# EAGLE schematic BSB-LAN-Full-SS (EAGLE 6.6.0)
REVISION: v1.0

## Sheet 1 of 4
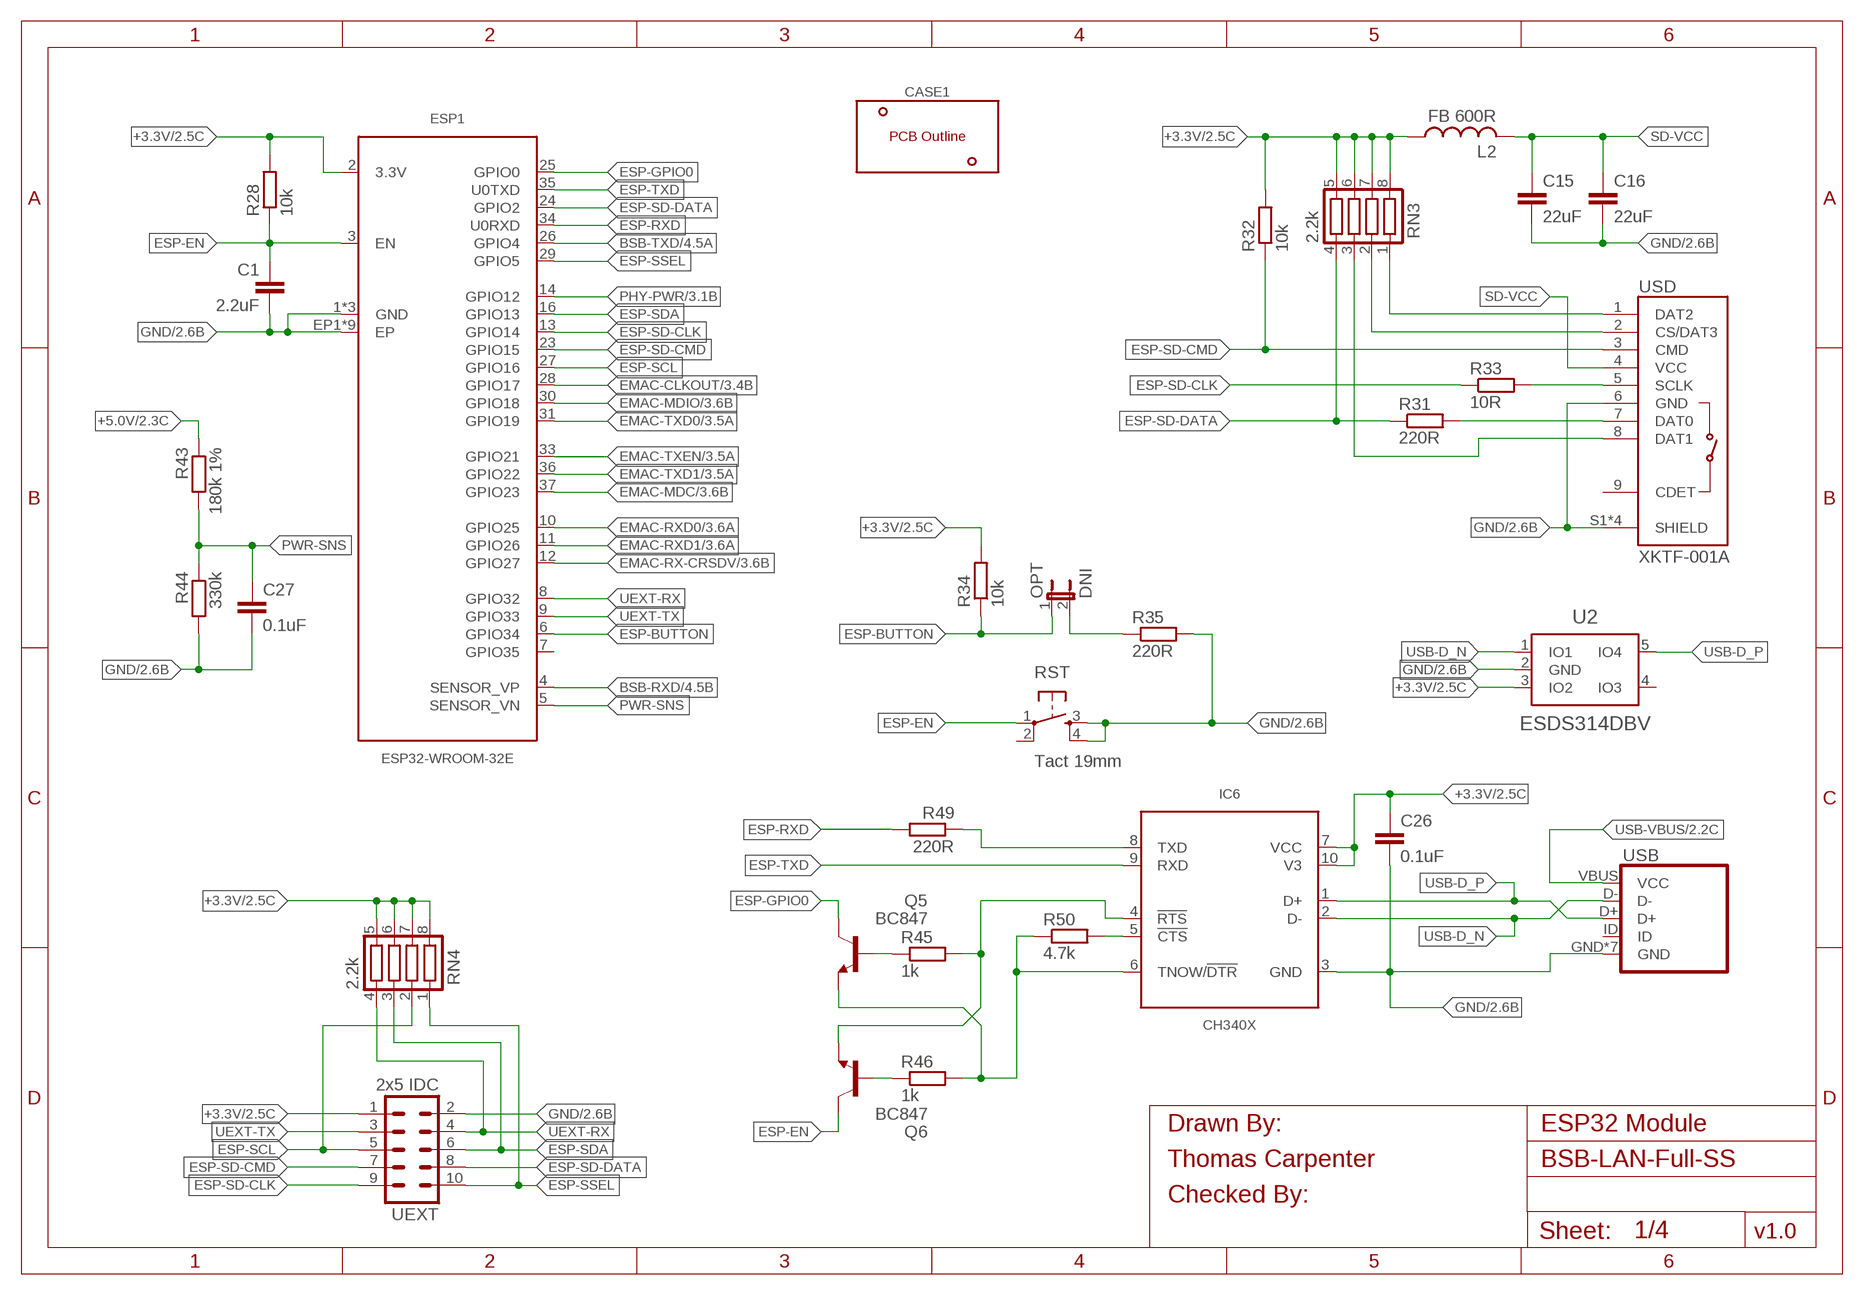
[diagram p0: schematic, sheet 1]
FRAME4 (A4L-LOC): DRAWN_BY: Thomas Carpenter; SHEET_NAME: ESP32 Module

### Parts
C1  2.2uF  C-EUC0603  [C0603]
C15  22uF  C-EUC0805L  [C0805L]
C16  22uF  C-EUC0805L  [C0805L]
C26  0.1uF  C-EUC0402  [C0402]
C27  0.1uF  C-EUC0402  [C0402]
CASE1  DNI  CNMB/3  [CNMB/3-]
ESP1  ESP32-WROOM-32E  [ESP32-WROOM-32E]
IC6  CH340X  [MSOP10]
L2  FB 600R  L-USL0805  [L2010]
OPT  DNI  JUMPER-2-PTH  [1X02]
Q5  BC847  [SOT23]
Q6  BC847  [SOT23]
R28  10k  R-EU_R0402  [R0402]
R31  220R  R-EU_R0402  [R0402]
R32  10k  R-EU_R0402  [R0402]
R33  10R  R-EU_R0603L  [R0603L]
R34  10k  R-EU_R0402  [R0402]
R35  220R  R-EU_R0402  [R0402]
R43  180k 1%  R-EU_R0402  [R0402]
R44  330k  R-EU_R0603L  [R0603L]
R45  1k  R-EU_R0402  [R0402]
R46  1k  R-EU_R0402  [R0402]
R49  220R  R-EU_R0402  [R0402]
R50  4.7k  R-EU_R0402  [R0402]
RN3  2.2k  R-NET-04-R1206  [CTS742C083]
RN4  2.2k  R-NET-04-R1206  [CTS742C083]
RST  Tact 19mm  SWITCH-MOMENTARY  [TACTILE_SWITCH]
U2  ESDS314DBV  [DBV0005A-SOT23]
UEXT  2x5 IDC  ML10  [ML10]
USB  ZX62-B-5PA(33)  USB_MICROB_PLUG  [USB-MICROB]
USD  XKTF-001A  MICROSD  [MICRO-SD]

### Nets
+3.3V [ESP32]: C26.1 ESP1.2(3.3V) IC6.7(VCC) IC6.10(V3) L2.1 R28.2 R32.2 R34.2 RN3.5 RN3.6 RN3.7 RN3.8 RN4.5 RN4.6 RN4.7 RN4.8 U2.3(IO2) UEXT.1 ; also sheet 2,3,4
+5.0V [ESP32]: R43.1 ; also sheet 2
BSB-RXD [ESP32]: ESP1.4(SENSOR_VP) ; also sheet 4
BSB-TXD [ESP32]: ESP1.26(GPIO4) ; also sheet 4
CH340-!CTS [ESP32]: IC6.5(!CTS) R50.2
CH340-!DTR [ESP32]: IC6.6(TNOW/!DTR) Q5.2(E) R46.2 R50.1
CH340-!RTS [ESP32]: IC6.4(!RTS) Q6.2(E) R45.2
CH340-TXD [ESP32]: IC6.8(TXD) R49.1
EMAC-CLKOUT [ESP32]: ESP1.28(GPIO17) ; also sheet 3
EMAC-MDC [ESP32]: ESP1.37(GPIO23) ; also sheet 3
EMAC-MDIO [ESP32]: ESP1.30(GPIO18) ; also sheet 3
EMAC-RX-CRSDV [ESP32]: ESP1.12(GPIO27) ; also sheet 3
EMAC-RXD0 [ESP32]: ESP1.10(GPIO25) ; also sheet 3
EMAC-RXD1 [ESP32]: ESP1.11(GPIO26) ; also sheet 3
EMAC-TXD0 [ESP32]: ESP1.31(GPIO19) ; also sheet 3
EMAC-TXD1 [ESP32]: ESP1.36(GPIO22) ; also sheet 3
EMAC-TXEN [ESP32]: ESP1.33(GPIO21) ; also sheet 3
ESP-BUTTON [ESP32]: ESP1.6(GPIO34) OPT.1 R34.1
ESP-BUTTON-R [ESP32]: OPT.2 R35.1
ESP-EN [ESP32]: C1.1 ESP1.3(EN) Q6.3(C) R28.1 RST.1
ESP-EN-OE [ESP32]: Q6.1(B) R46.1
ESP-GPIO0 [ESP32]: ESP1.25(GPIO0) Q5.3(C)
ESP-GPIO0-OE [ESP32]: Q5.1(B) R45.1
ESP-RXD [ESP32]: ESP1.34(U0RXD) R49.2
ESP-SCL [ESP32]: ESP1.27(GPIO16) RN4.2 UEXT.5
ESP-SD-CLK [ESP32]: ESP1.13(GPIO14) R33.1 UEXT.9
ESP-SD-CMD [ESP32]: ESP1.23(GPIO15) R32.1 UEXT.7 USD.3(CMD)
ESP-SD-DATA [ESP32]: ESP1.24(GPIO2) R31.1 RN3.4 UEXT.8
ESP-SDA [ESP32]: ESP1.16(GPIO13) RN4.3 UEXT.6
ESP-SSEL [ESP32]: ESP1.29(GPIO5) RN4.1 UEXT.10
ESP-TXD [ESP32]: ESP1.35(U0TXD) IC6.9(RXD)
GND [ESP32]: C1.2 C15.2 C16.2 C26.2 C27.2 ESP1.1(GND) ESP1.15(GND) ESP1.38(GND) ESP1.EP1(EP) ESP1.EP2(EP) ESP1.EP3(EP) ESP1.EP4(EP) ESP1.EP5(EP) ESP1.EP6(EP) ESP1.EP7(EP) ESP1.EP8(EP) ESP1.EP9(EP) IC6.3(GND) R35.2 R44.2 RST.3 RST.4 U2.2(GND) UEXT.2 USB.GND USB.MT1(GND) USB.MT2(GND) USB.MT3(GND) USB.MT4(GND) USB.MT5(GND) USB.MT6(GND) USD.6(GND) USD.S1(SHIELD) USD.S2(SHIELD) USD.S3(SHIELD) USD.S4(SHIELD) ; also sheet 2,3,4
PHY-PWR [ESP32]: ESP1.14(GPIO12) ; also sheet 3
PWR-SNS [ESP32]: C27.1 ESP1.5(SENSOR_VN) R43.2 R44.1
SD-DAT0 [ESP32]: R31.2 USD.7(DAT0)
SD-DAT1 [ESP32]: RN3.3 USD.8(DAT1)
SD-DAT2 [ESP32]: RN3.1 USD.1(DAT2)
SD-DAT3 [ESP32]: RN3.2 USD.2(CS/DAT3)
SD-SCLK [ESP32]: R33.2 USD.5(SCLK)
SD-VCC [ESP32]: C15.1 C16.1 L2.2 USD.4(VCC)
UEXT-RX: ESP1.8(GPIO32) RN4.4 UEXT.4
UEXT-TX [ESP32]: ESP1.9(GPIO33) UEXT.3
USB-D_N [100R]: IC6.2(D-) U2.1(IO1) USB.D-
USB-D_P [100R]: IC6.1(D+) U2.5(IO4) USB.D+
USB-VBUS [ESP32]: USB.VBUS(VCC) ; also sheet 2
Unconnected: ESP1.7(GPIO35) RST.2 U2.4(IO3) USB.ID USD.9(CDET)

## Sheet 2 of 4
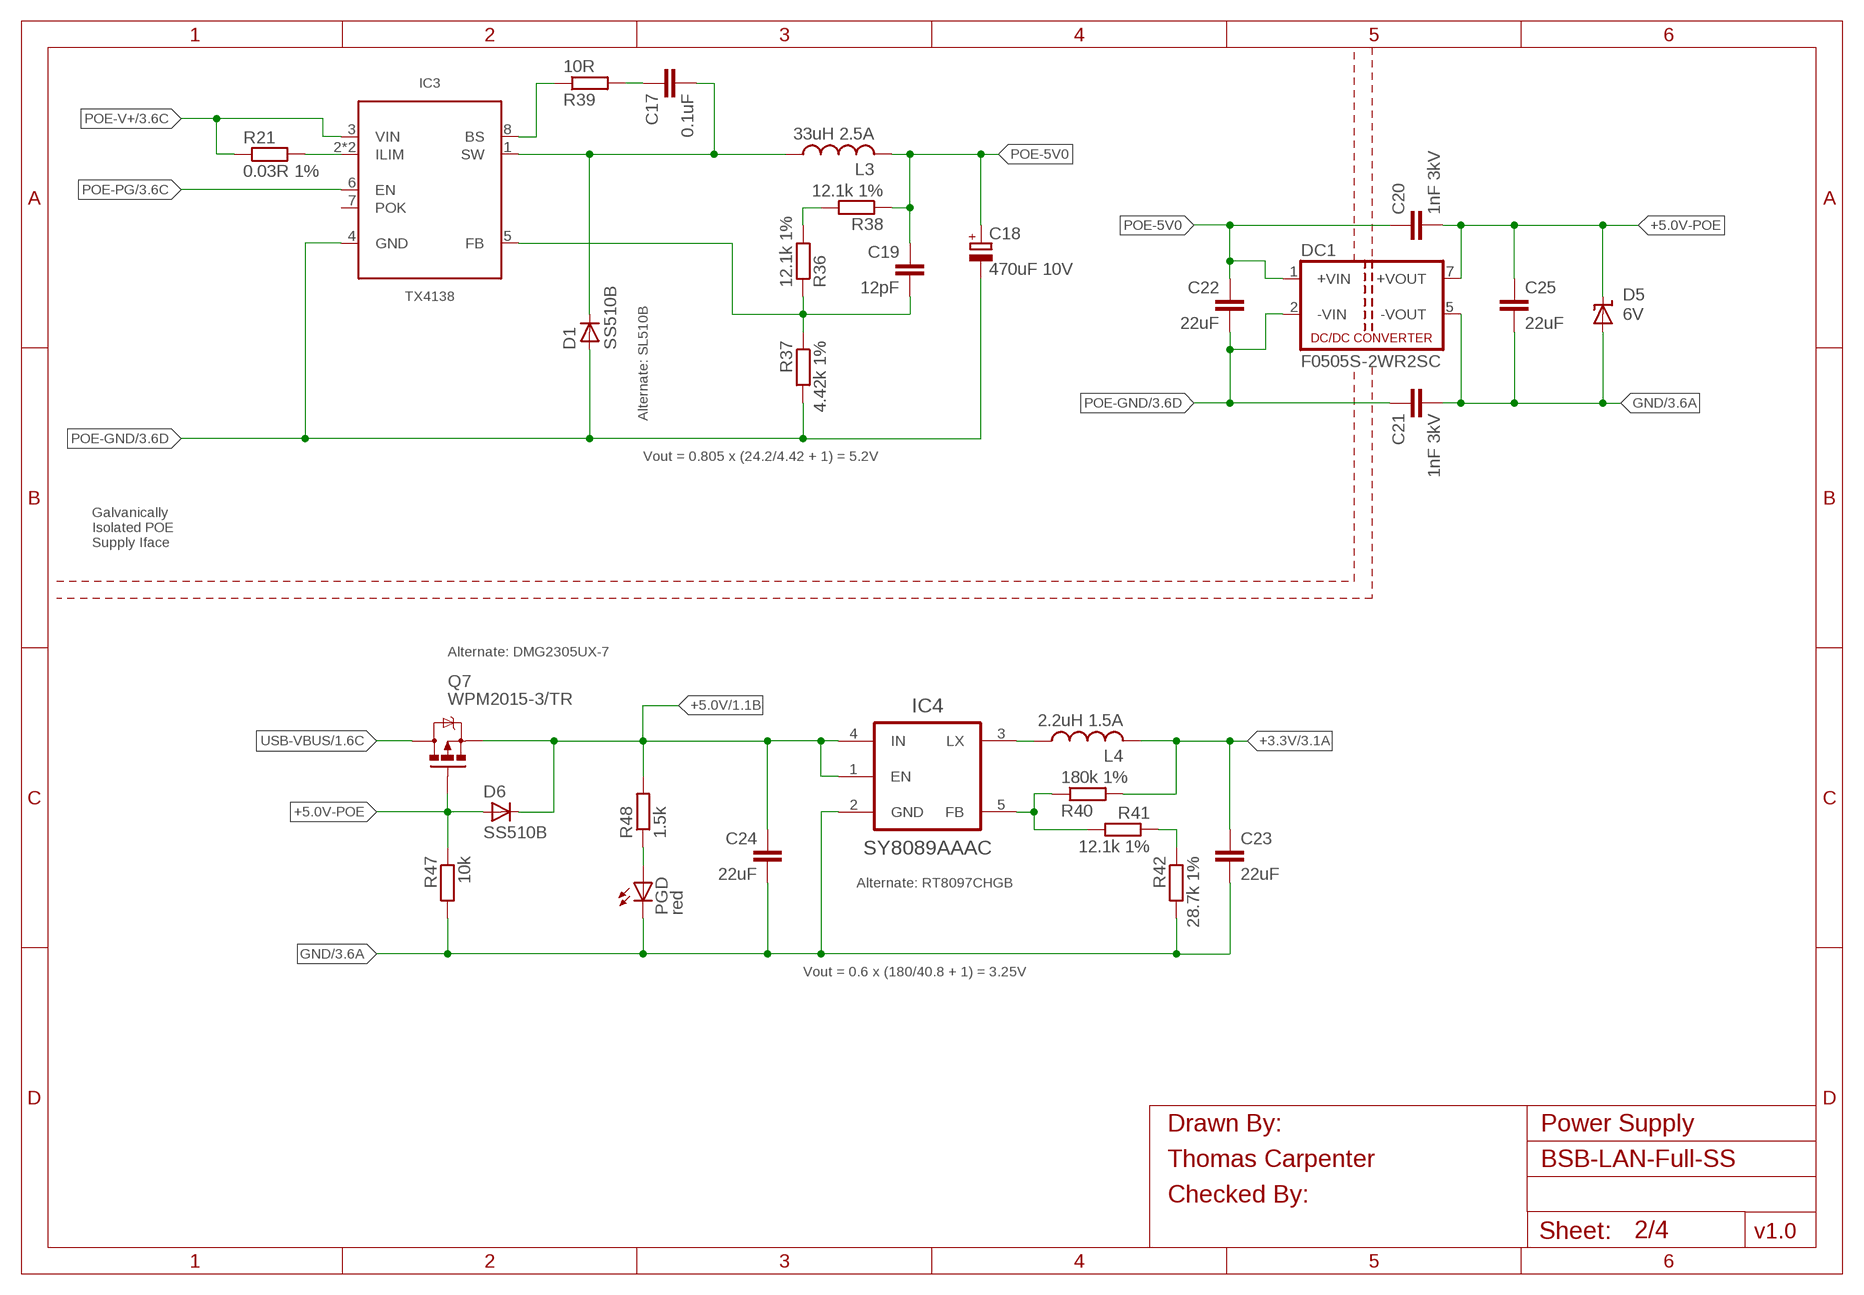
[diagram p1: schematic, sheet 2]
FRAME3 (A4L-LOC): DRAWN_BY: Thomas Carpenter; SHEET_NAME: Power Supply

### Parts
C17  0.1uF  C-EUC0603L  [C0603L]
C18  470uF 10V  CPOL-EUSMCD  [SMC_D]
C19  12pF  C-EUC0402  [C0402]
C20  1nF 3kV  C-EUC1808  [C1808]
C21  1nF 3kV  C-EUC1808  [C1808]
C22  22uF  C-EUC0805  [C0805]
C23  22uF  C-EUC0805  [C0805]
C24  22uF  C-EUC0805  [C0805]
C25  22uF  C-EUC0805  [C0805]
D1  SS510B  DIODE-SMB  [SMB]
D5  6V  TVS-UNISMA  [SMA]
D6  SS510B  DIODE-SMB  [SMB]
DC1  F0505S-2WR2SC  [SIP7-N]
IC3  TX4138  [SOIC8-EP]
IC4  SY8089AAAC  [DBV0005A-SOT23]
L3  33uH 2.5A  L-USL6560P  [L6560P]
L4  2.2uH 1.5A  L-USL4040P  [L4040P]
PGD  red  LEDCHIPLED_0603  [CHIP-LED0603]
Q7  WPM2015-3/TR  [SOT23]
R21  0.03R 1%  R-EU_R1206  [R1206]
R36  12.1k 1%  R-EU_R0402  [R0402]
R37  4.42k 1%  R-EU_R0402  [R0402]
R38  12.1k 1%  R-EU_R0402  [R0402]
R39  10R  R-EU_R0603L  [R0603L]
R40  180k 1%  R-EU_R0402  [R0402]
R41  12.1k 1%  R-EU_R0402  [R0402]
R42  28.7k 1%  R-EU_R0402  [R0402]
R47  10k  R-EU_R0402  [R0402]
R48  1.5k  R-EU_R0603  [R0603]

### Nets
3V3-FB [ESP32]: IC4.5(FB) R40.1 R41.2
3V3-FB-RB [ESP32]: R41.1 R42.1
3V3-LX [ESP32]: IC4.3(LX) L4.1
+3.3V [ESP32]: C23.1 L4.2 R40.2 ; also sheet 1,3,4
+5.0V [ESP32]: C24.1 D6.C IC4.1(EN) IC4.4(IN) Q7.2(S) R48.2 ; also sheet 1
+5.0V-POE [ESP32]: C20.2 C25.1 D5.C D6.A DC1.7(+VOUT) Q7.1(G) R47.1
GND [ESP32]: C21.2 C23.2 C24.2 C25.2 D5.A DC1.5(-VOUT) IC4.2(GND) PGD.C R42.2 R47.2 ; also sheet 1,3,4
POE-5V0 [PoE-ISO]: C18.+ C19.1 C20.1 C22.1 DC1.1(+VIN) L3.2 R38.1
POE-DC-BS [PoE-ISO]: IC3.8(BS) R39.1
POE-DC-BS-RC [PoE-ISO]: C17.1 R39.2
POE-DC-FB [PoE-ISO]: C19.2 IC3.5(FB) R36.1 R37.1
POE-DC-FBRT [PoE-ISO]: R36.2 R38.2
POE-DC-ILIM [PoE-ISO]: IC3.2(ILIM) IC3.EP(ILIM) R21.2
POE-DC-SW [PoE-ISO]: C17.2 D1.C IC3.1(SW) L3.1
POE-GND [PoE-ISO]: C18.- C21.1 C22.2 D1.A DC1.2(-VIN) IC3.4(GND) R37.2 ; also sheet 3
POE-PG [PoE-ISO]: IC3.6(EN) ; also sheet 3
POE-V+ [PoE-ISO]: IC3.3(VIN) R21.1 ; also sheet 3
PWR-LED [ESP32]: PGD.A R48.1
USB-VBUS [ESP32]: Q7.3(D) ; also sheet 1
Unconnected: IC3.7(POK)

### Notes on the sheet
- Alternate: SL510B
- Vout = 0.805 x (24.2/4.42 + 1) = 5.2V
- Galvanically
  Isolated POE
  Supply Iface
- Alternate: DMG2305UX-7
- Alternate: RT8097CHGB
- Vout = 0.6 x (180/40.8 + 1) = 3.25V

## Sheet 3 of 4
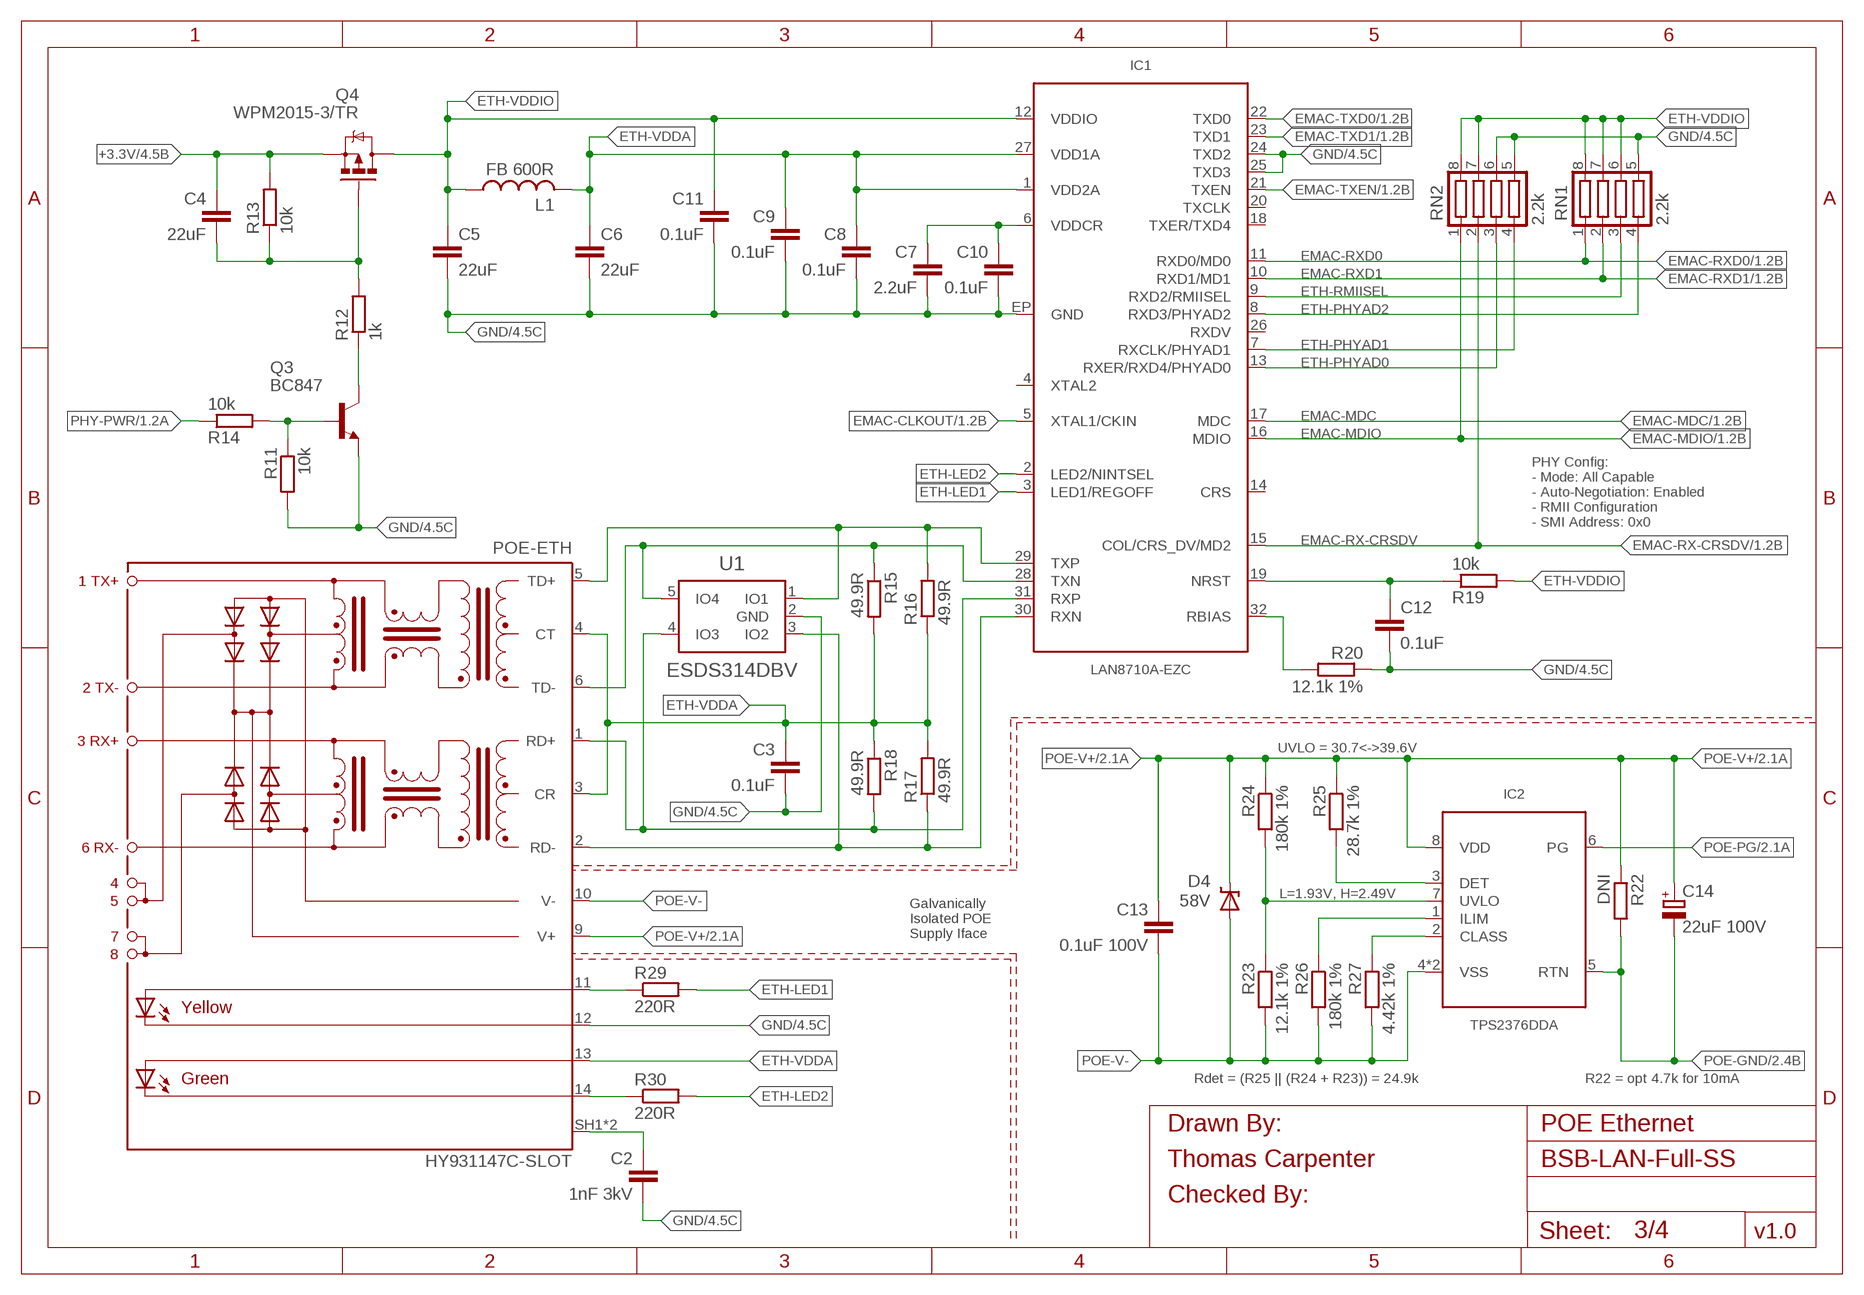
[diagram p2: schematic, sheet 3]
FRAME2 (A4L-LOC): DRAWN_BY: Thomas Carpenter; SHEET_NAME: POE Ethernet

### Parts
C2  1nF 3kV  C-EUC1808  [C1808]
C3  0.1uF  C-EUC0402  [C0402]
C4  22uF  C-EUC0805L  [C0805L]
C5  22uF  C-EUC0805L  [C0805L]
C6  22uF  C-EUC0805L  [C0805L]
C7  2.2uF  C-EUC0603  [C0603]
C8  0.1uF  C-EUC0402  [C0402]
C9  0.1uF  C-EUC0402  [C0402]
C10  0.1uF  C-EUC0402  [C0402]
C11  0.1uF  C-EUC0402  [C0402]
C12  0.1uF  C-EUC0402  [C0402]
C13  0.1uF 100V  C-EUC0603  [C0603]
C14  22uF 100V  CPOL-EUD  [PANASONIC_D]
D4  58V  TVS-UNISMA  [SMA]
IC1  LAN8710A-EZC  [QFN-5X5-32]
IC2  TPS2376DDA  [SOIC8-EP]
L1  FB 600R  L-USL0805  [L2010]
POE-ETH  HY931147C-SLOT  [HY931147C-SLOT]
Q3  BC847  [SOT23]
Q4  WPM2015-3/TR  [SOT23]
R11  10k  R-EU_R0402  [R0402]
R12  1k  R-EU_R0402  [R0402]
R13  10k  R-EU_R0402  [R0402]
R14  10k  R-EU_R0402  [R0402]
R15  49.9R  R-EU_R0402L  [R0402L]
R16  49.9R  R-EU_R0402L  [R0402L]
R17  49.9R  R-EU_R0402L  [R0402L]
R18  49.9R  R-EU_R0402L  [R0402L]
R19  10k  R-EU_R0402  [R0402]
R20  12.1k 1%  R-EU_R0402  [R0402]
R22  DNI  R-EU_R1206  [R1206]
R23  12.1k 1%  R-EU_R0402  [R0402]
R24  180k 1%  R-EU_R0402  [R0402]
R25  28.7k 1%  R-EU_R0402  [R0402]
R26  180k 1%  R-EU_R0402  [R0402]
R27  4.42k 1%  R-EU_R0402  [R0402]
R29  220R  R-EU_R0402  [R0402]
R30  220R  R-EU_R0402  [R0402]
RN1  2.2k  R-NET-04-R1206  [CTS742C083]
RN2  2.2k  R-NET-04-R1206  [CTS742C083]
U1  ESDS314DBV  [DBV0005A-SOT23]

### Nets
+3.3V [ESP32]: C4.1 Q4.2(S) R13.2 ; also sheet 1,2,4
EMAC-CLKOUT [ESP32]: IC1.5(XTAL1/CKIN) ; also sheet 1
EMAC-MDC [ESP32]: IC1.17(MDC) ; also sheet 1
EMAC-MDIO [ESP32]: IC1.16(MDIO) RN2.1 ; also sheet 1
EMAC-RX-CRSDV [ESP32]: IC1.15(COL/CRS_DV/MD2) RN2.2 ; also sheet 1
EMAC-RXD0 [ESP32]: IC1.11(RXD0/MD0) RN1.1 ; also sheet 1
EMAC-RXD1 [ESP32]: IC1.10(RXD1/MD1) RN1.2 ; also sheet 1
EMAC-TXD0 [ESP32]: IC1.22(TXD0) ; also sheet 1
EMAC-TXD1 [ESP32]: IC1.23(TXD1) ; also sheet 1
EMAC-TXEN [ESP32]: IC1.21(TXEN) ; also sheet 1
ETH-LED1 [ESP32]: IC1.3(LED1/REGOFF) R29.2
ETH-LED1-A [ESP32]: POE-ETH.11(YA) R29.1
ETH-LED2 [ESP32]: IC1.2(LED2/NINTSEL) R30.2
ETH-LED-G-K [ESP32]: POE-ETH.14(GK) R30.1
ETH-PHYAD0 [ESP32]: IC1.13(RXER/RXD4/PHYAD0) RN2.3
ETH-PHYAD1 [ESP32]: IC1.7(RXCLK/PHYAD1) RN2.4
ETH-PHYAD2 [ESP32]: IC1.8(RXD3/PHYAD2) RN1.4
ETH-PWR-B [ESP32]: Q3.1(B) R11.1 R14.2
ETH-PWR-C [ESP32]: Q3.3(C) R12.1
ETH-PWR-G [ESP32]: C4.2 Q4.1(G) R12.2 R13.1
ETH-RBIAS [ESP32]: IC1.32(RBIAS) R20.2
ETH-RD_N [100R]: IC1.30(RXN) POE-ETH.2(RD-) R17.1 U1.3(IO2)
ETH-RD_P [100R]: IC1.31(RXP) POE-ETH.1(RD+) R18.2 U1.4(IO3)
ETH-RMIISEL [ESP32]: IC1.9(RXD2/RMIISEL) RN1.3
ETH-RST [ESP32]: C12.1 IC1.19(NRST) R19.1
ETH-SHLD [Sheild]: C2.1 POE-ETH.SH1(SLD) POE-ETH.SH2(SLD)
ETH-TD_N [100R]: IC1.28(TXN) POE-ETH.6(TD-) R15.1 U1.5(IO4)
ETH-TD_P [100R]: IC1.29(TXP) POE-ETH.5(TD+) R16.2 U1.1(IO1)
ETH-VDDA [ESP32]: C3.1 C6.1 C8.1 C9.1 IC1.1(VDD2A) IC1.27(VDD1A) L1.2 POE-ETH.3(CR) POE-ETH.4(CT) POE-ETH.13(GA) R15.2 R16.1 R17.2 R18.1
ETH-VDDCR [ESP32]: C7.1 C10.1 IC1.6(VDDCR)
ETH-VDDIO [ESP32]: C5.1 C11.1 IC1.12(VDDIO) L1.1 Q4.3(D) R19.2 RN1.6 RN1.7 RN1.8 RN2.7 RN2.8
GND [ESP32]: C2.2 C3.2 C5.2 C6.2 C7.2 C8.2 C9.2 C10.2 C11.2 C12.2 IC1.24(TXD2) IC1.25(TXD3) IC1.EP(GND) POE-ETH.12(YK) Q3.2(E) R11.2 R20.1 RN1.5 RN2.5 RN2.6 U1.2(GND) ; also sheet 1,2,4
PHY-PWR [ESP32]: R14.1 ; also sheet 1
POE-CLASS [PoE-ISO]: IC2.2(CLASS) R27.1
POE-DET [PoE-ISO]: IC2.3(DET) R25.2
POE-GND [PoE-ISO]: C14.- IC2.5(RTN) R22.2 ; also sheet 2
POE-ILIM [PoE-ISO]: IC2.1(ILIM) R26.1
POE-PG [PoE-ISO]: IC2.6(PG) ; also sheet 2
POE-UVLO [PoE-ISO]: IC2.7(UVLO) R23.1 R24.2
POE-V+ [PoE-ISO]: C13.1 C14.+ D4.C IC2.8(VDD) POE-ETH.9(V+) R22.1 R24.1 R25.1 ; also sheet 2
POE-V- [PoE-ISO]: C13.2 D4.A IC2.4(VSS) IC2.EP(VSS) POE-ETH.10(V-) R23.2 R26.2 R27.2
Unconnected: IC1.4(XTAL2) IC1.14(CRS) IC1.18(TXER/TXD4) IC1.20(TXCLK) IC1.26(RXDV)

### Notes on the sheet
- PHY Config:
  - Mode: All Capable
  - Auto-Negotiation: Enabled
  - RMII Configuration
  - SMI Address: 0x0
- UVLO = 30.7<->39.6V
- L=1.93V, H=2.49V
- Galvanically
  Isolated POE
  Supply Iface
- Rdet = (R25 || (R24 + R23)) = 24.9k | R22 = opt 4.7k for 10mA

## Sheet 4 of 4
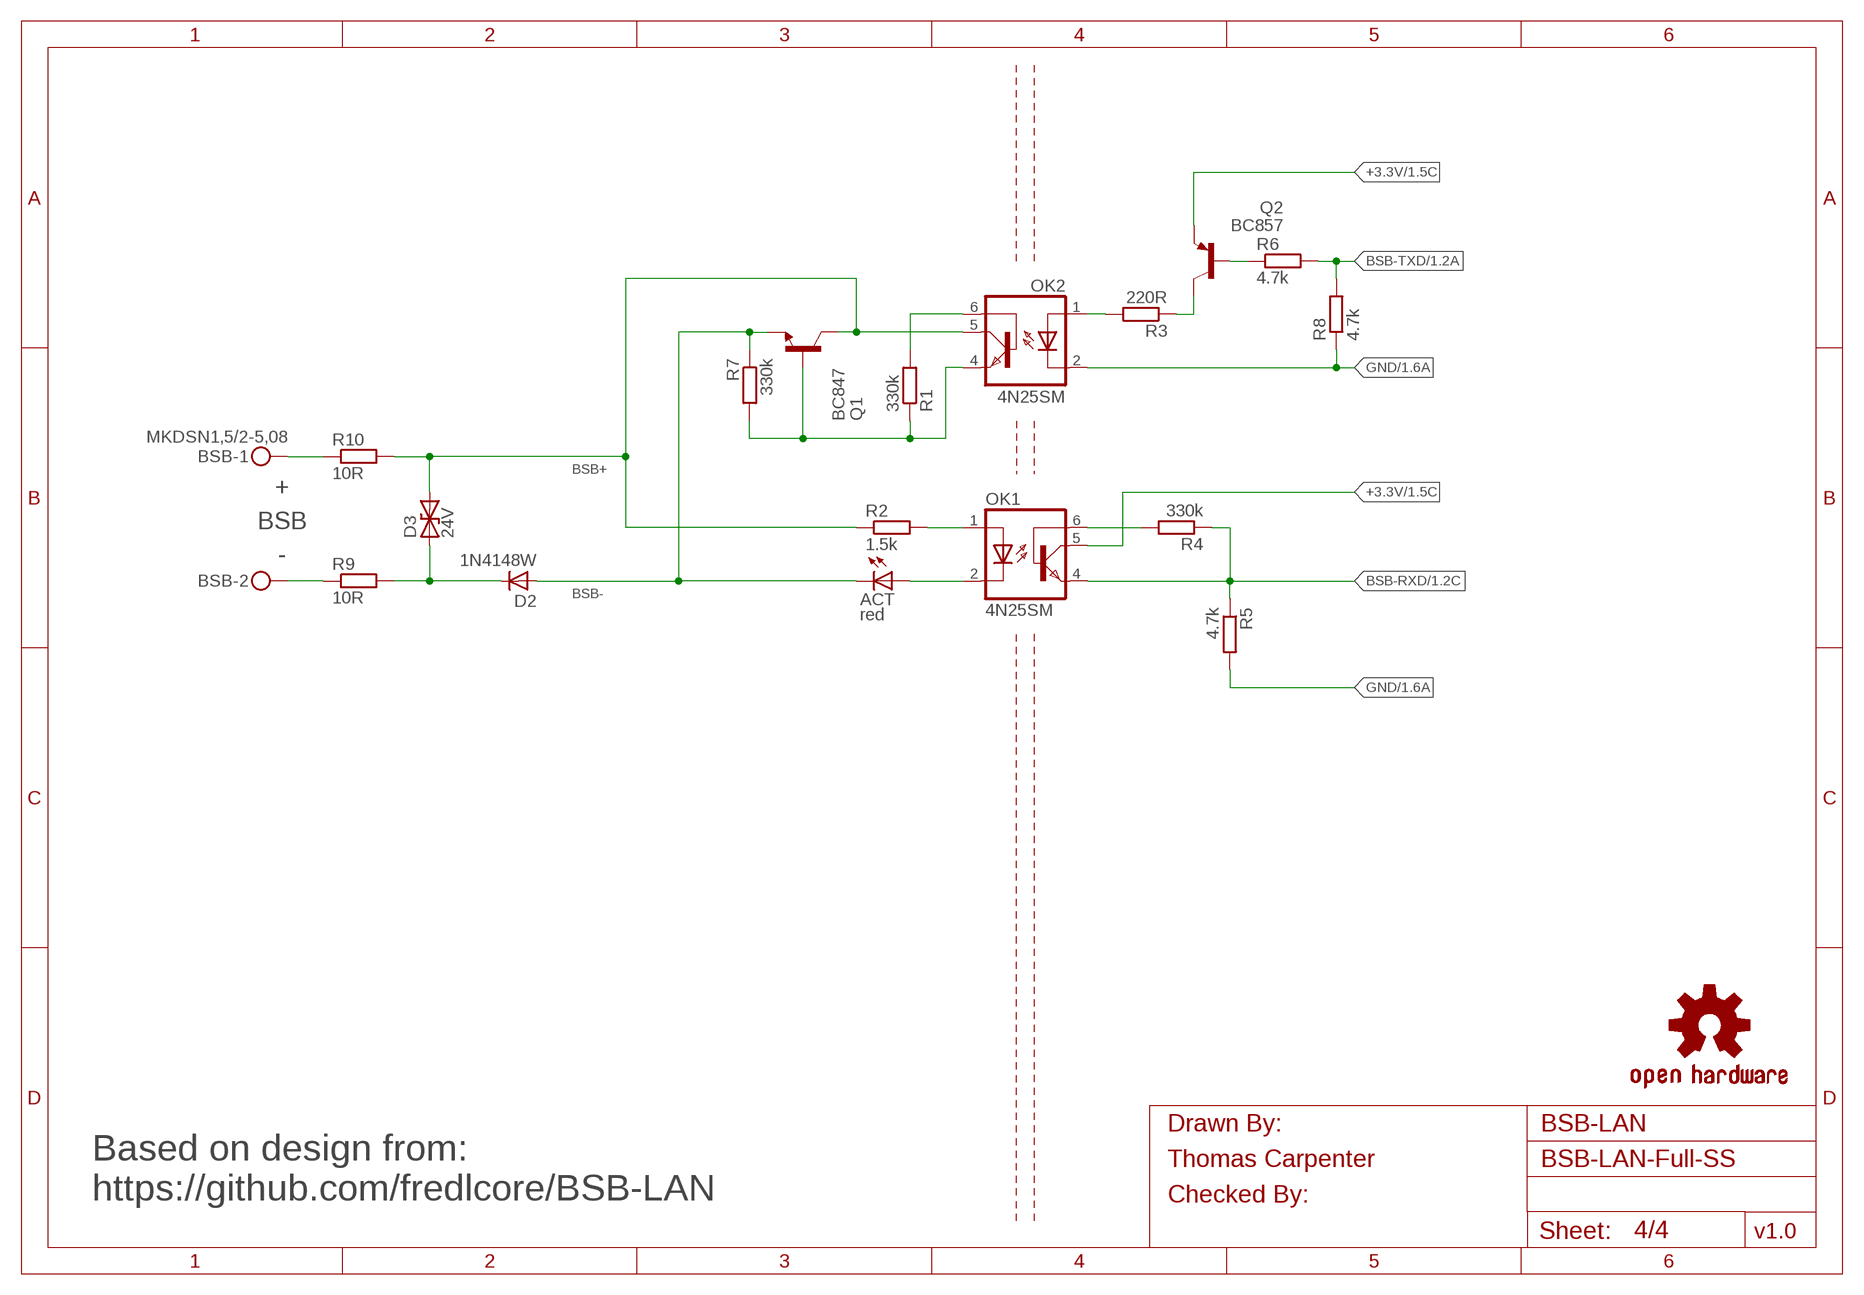
[diagram p3: schematic, sheet 4]
FRAME1 (A4L-LOC): DRAWN_BY: Thomas Carpenter; SHEET_NAME: BSB-LAN

### Parts
ACT  red  LEDCHIPLED_0603  [CHIP-LED0603]
BSB  MKDSN1,5/2-5,08  [MKDSN1_5-2-5_08]
D2  1N4148W  DIODE-SOD123  [SOD123]
D3  24V  TVS-BIDIRSMB  [SMBG]
OK1  4N25SM  [DIL6-SMD]
OK2  4N25SM  [DIL6-SMD]
Q1  BC847  [SOT23]
Q2  BC857  [SOT23-BEC]
R1  330k  R-EU_R0603  [R0603]
R2  1.5k  R-EU_R0603  [R0603]
R3  220R  R-EU_R0402  [R0402]
R4  330k  R-EU_R0603  [R0603]
R5  4.7k  R-EU_R0402  [R0402]
R6  4.7k  R-EU_R0402  [R0402]
R7  330k  R-EU_R0603  [R0603]
R8  4.7k  R-EU_R0402  [R0402]
R9  10R  R-EU_R0603  [R0603]
R10  10R  R-EU_R0603  [R0603]
U$3  DNI  OSHW-LOGOM  [OSHW-LOGO-M]

### Nets
+3.3V [ESP32]: OK1.5(COL) Q2.E ; also sheet 1,2,3
BSB+ [B2B-ISO]: D3.2 OK2.5(COL) Q1.3(C) R2.1 R10.2
BSB- [B2B-ISO]: ACT.C D2.A Q1.2(E) R7.1
BSB-RX-A [B2B-ISO]: OK1.1(A) R2.2
BSB-RX-K [B2B-ISO]: ACT.A OK1.2(C)
BSB-RXD [ESP32]: OK1.4(EMI) R4.1 R5.1 ; also sheet 1
BSB-TX-B [B2B-ISO]: OK2.6(BAS) R1.2
BSB-TX-E [B2B-ISO]: OK2.4(EMI) Q1.1(B) R1.1 R7.2
BSB-TXD [ESP32]: R6.2 R8.2 ; also sheet 1
CON-BSB+ [B2B-ISO]: BSB.1 R10.1
CON-BSB- [B2B-ISO]: BSB.2 R9.1
GND [ESP32]: OK2.2(C) R5.2 R8.1 ; also sheet 1,2,3
RXD-B [ESP32]: OK1.6(BAS) R4.2
TVS-BSB- [B2B-ISO]: D2.C D3.1 R9.2
TXD-A [ESP32]: OK2.1(A) R3.2
TXD-B [ESP32]: Q2.B R6.1
TXD-C [ESP32]: Q2.C R3.1

### Notes on the sheet
- +
  BSB
  -
- Based on design from:
  https://github.com/fredlcore/BSB-LAN

## Library data of the parts
ACT PGD = BSB-LAN:LED: LED OSRAM: - CHIPLED LG R971, LG N971, LY N971, LG Q971, LY Q971, LO R971, LY R971 LH N974, LH R974 LS Q976, LO Q976, LY Q976 LO Q996 - Hyper CHIPLED LW Q18S LB Q993, LB Q99A, LB R99A - SideLED LS A670, LO A670, LY A670, LG A670, LP A670 LB A673, LV A673, LT A673, LW A673 LH A674 LY A675 LS A676, LA A676, LO A676, LY A676, LW A676 LS A679, LY A679, LG A679 - Hyper Micro SIDELED® LS Y876, LA Y876, LO Y876, LY Y876 LT Y87S - SmartLED LW L88C, LW L88S LB L89C, LB L89S, LG L890 LS L89K, LO L89K, LY L89K LS L896, LA L896, LO L896, LY L896 - TOPLED LS T670, LO T670, LY T670, LG T670, LP T670 LSG T670, LSP T670, LSY T670, LOP T670, LYG T670 LG T671, LOG T671, LSG T671 LB T673, LV T673, LT T673, LW T673 LH T674 LS T676, LA T676, LO T676, LY T676, LB T676, LH T676, LSB T676, LW T676 LB T67C, LV T67C, LT T67C, LS T67K, LO T67K, LY T67K, LW E67C LS E67B, LA E67B, LO E67B, LY E67B, LB E67C, LV E67C, LT E67C LW T67C LS T679, LY T679, LG T679 LS T770, LO T770, LY T770, LG T770, LP T770 LB T773, LV T773, LT T773, LW T773 LH T774 LS E675, LA E675, LY E675, LS T675 LS T776, LA T776, LO T776, LY T776, LB T776 LHGB T686 LT T68C, LB T68C - Hyper Mini TOPLED® LB M676 - Mini TOPLED Santana® LG M470 LS M47K, LO M47K, LY M47K Source: http://www.osram.convergy.de LUXEON: - LUMILED® LXK2-PW12-R00, LXK2-PW12-S00, LXK2-PW14-U00, LXK2-PW14-V00 LXK2-PM12-R00, LXK2-PM12-S00, LXK2-PM14-U00 LXK2-PE12-Q00, LXK2-PE12-R00, LXK2-PE12-S00, LXK2-PE14-T00, LXK2-PE14-U00 LXK2-PB12-K00, LXK2-PB12-L00, LXK2-PB12-M00, LXK2-PB14-N00, LXK2-PB14-P00, LXK2-PB14-Q00 LXK2-PR12-L00, LXK2-PR12-M00, LXK2-PR14-Q00, LXK2-PR14-R00 LXK2-PD12-Q00, LXK2-PD12-R00, LXK2-PD12-S00 LXK2-PH12-R00, LXK2-PH12-S00 LXK2-PL12-P00, LXK2-PL12-Q00, LXK2-PL12-R00 Source: www.luxeon.com KINGBRIGHT: KA-3528ASYC Source: www.kingbright.com; JLC_ROT: 270; LCSC_PART: C2286
BSB = BSB-LAN:MKDSN1,5/2-5,08: MKDSN 1,5/ 2-5,08 Printklemme Nennstrom: 13,5 A Nennspannung: 250 V Rastermaß: 5,08 mm Polzahl: 2 Anschlussart: Schraubanschluss Montage: Löten Anschlussrichtung Leiter/Platine: 0 ° Artikelnummer: 1729128 Source: http://eshop.phoenixcontact.com .. 1729128.pdf; LCSC_PART: C5183989
C1 C7 = BSB-LAN:C-EU: CAPACITOR, European symbol; LCSC_PART: C23630
C2 C20 C21 = BSB-LAN:C-EU: CAPACITOR, European symbol; LCSC_PART: C577300
C3 C8-C12 C26 C27 = BSB-LAN:C-EU: CAPACITOR, European symbol; LCSC_PART: C1525
C4-C6 C15 C16 C22-C25 = BSB-LAN:C-EU: CAPACITOR, European symbol; LCSC_PART: C45783
C13 C17 = BSB-LAN:C-EU: CAPACITOR, European symbol; LCSC_PART: C113803
C14 = BSB-LAN:CPOL-EU: POLARIZED CAPACITOR, European symbol; LCSC_PART: C487431
C18 = BSB-LAN:CPOL-EU: POLARIZED CAPACITOR, European symbol; LCSC_PART: C4944894
C19 = BSB-LAN:C-EU: CAPACITOR, European symbol; LCSC_PART: C1547
CASE1 = BSB-LAN:CNMB
D1 D6 = BSB-LAN:DIODE-: DIODE; LCSC_PART: C65011
D2 = BSB-LAN:DIODE-: DIODE; LCSC_PART: C81598
D3 = BSB-LAN:TVS-BIDIR: Bidirectional TVS Suppressor Diode SMAJxx(C)A Voltage Suppressor - SMA Package (DO-214AC) SMBJxx(C)A Voltage Suppressor - SMB Package (DO-214AA) SMCJxx(C)A Voltage Suppressor - SMC Package (DO-214AB); LCSC_PART: C83268
D4 = BSB-LAN:TVS-UNI: Suppressor diode; LCSC_PART: C151246
D5 = BSB-LAN:TVS-UNI: Suppressor diode; LCSC_PART: C223993
DC1 = BSB-LAN:F*S-2WR2: DC-DC CONVERTER; LCSC_PART: C909777
ESP1 = BSB-LAN:ESP32-WROOM; JLC_ROT: 270; JLC_Y: 7.72; LCSC_PART: C701341
IC1 = BSB-LAN:LAN8710A; JLC_ROT: 270; LCSC_PART: C46185
IC2 = BSB-LAN:TPS237*; LCSC_PART: C544899
IC3 = BSB-LAN:TX4138; LCSC_PART: C329267
IC4 = BSB-LAN:SY8089*?C; JLC_ROT: 270; LCSC_PART: C78988
IC6 = BSB-LAN:CH340X; LCSC_PART: C3035748
L1 L2 = BSB-LAN:L-US: INDUCTOR, American symbol; LCSC_PART: C1017
L3 = BSB-LAN:L-US: INDUCTOR, American symbol; LCSC_PART: C2839927
L4 = BSB-LAN:L-US: INDUCTOR, American symbol; LCSC_PART: C135262
OK1 OK2 = BSB-LAN:4N*?M: General Purpose 6-Pin Phototransistor Optocouplers Source: http://www.fairchildsemi.com/ds/4N/4N35-M.pdf; LCSC_PART: C258246
OPT = BSB-LAN:JUMPER-2: Jumper Basic 0.1" spaced jumper. Use with breakaway headers.
POE-ETH = BSB-LAN:HY931147C: HANRUN HY931147C RJ45 w/ POE Ethernet Jack with magnetics and POE rectifiers. Manufacturer HANRUN(Zhongshan HanRun Elec) MFR.Part # HY931147C; JLC_ROT: 270; JLC_Y: -2.42; LCSC_PART: C91754
Q1 Q3 Q5 Q6 = BSB-LAN:BC847*: NPN Transistor; JLC_ROT: 270; LCSC_PART: C130417
Q2 = BSB-LAN:BC857*: PNP Transistror; JLC_ROT: 270; LCSC_PART: C426782
Q4 Q7 = BSB-LAN:WPM2015; JLC_ROT: 270; LCSC_PART: C7472861
R1 R4 R7 R44 = BSB-LAN:R-EU_: RESISTOR, European symbol; LCSC_PART: C23137
R2 R48 = BSB-LAN:R-EU_: RESISTOR, European symbol; LCSC_PART: C22843
R3 R29-R31 R35 R49 = BSB-LAN:R-EU_: RESISTOR, European symbol; LCSC_PART: C25091
R5 R6 R8 R50 = BSB-LAN:R-EU_: RESISTOR, European symbol; LCSC_PART: C25900
R9 R10 R33 R39 = BSB-LAN:R-EU_: RESISTOR, European symbol; LCSC_PART: C22859
R11 R13 R14 R19 R28 R32 R34 R47 = BSB-LAN:R-EU_: RESISTOR, European symbol; LCSC_PART: C25744
R12 R45 R46 = BSB-LAN:R-EU_: RESISTOR, European symbol; LCSC_PART: C11702
R15-R18 = BSB-LAN:R-EU_: RESISTOR, European symbol; LCSC_PART: C25120
R20 R23 R36 R38 R41 = BSB-LAN:R-EU_: RESISTOR, European symbol; LCSC_PART: C25852
R21 = BSB-LAN:R-EU_: RESISTOR, European symbol; LCSC_PART: C163046
R22 = BSB-LAN:R-EU_: RESISTOR, European symbol
R24 R26 R40 R43 = BSB-LAN:R-EU_: RESISTOR, European symbol; LCSC_PART: C25760
R25 R42 = BSB-LAN:R-EU_: RESISTOR, European symbol; LCSC_PART: C26972
R27 R37 = BSB-LAN:R-EU_: RESISTOR, European symbol; LCSC_PART: C52269
RN1-RN4 = BSB-LAN:R-NET-04: Chip Resistor Array 4 Single Resistor Source: http://www.ctscorp.com/components/Datasheets/CTSChipArrayDs.pdf; JLC_ROT: 270; LCSC_PART: C414564
RST = BSB-LAN:SWITCH-MOMENTARY: Momentary Switch Button commonly used for reset or general input. Spark Fun Electronics SKU : COM-00097 Surface mount is FSMCTTR from TE Connectivity.; LCSC_PART: C2837529
U1 U2 = BSB-LAN:ESDS314; LCSC_PART: C1847859
U$3 = BSB-LAN:OSHW-LOGO: Open Source Hardware Logo This logo indicates the piece of hardware it is found on incorporates a OSHW license and/or adheres to the definition of open source hardware found here: http://freedomdefined.org/OSHW
UEXT = BSB-LAN:ML10: HARTING; LCSC_PART: C5665
USB = BSB-LAN:USB_MICROB_PLUG; JLC_Y: 1.2; LCSC_PART: C132561
USD = BSB-LAN:MICROSD: microSD Socket Push-push type uSD socket with card detect switch.; JLC_X: 7.28; JLC_Y: -8.1; LCSC_PART: C381079

## Net classes
1 100R: width 0.175 mm, drill 0.25 mm, clearance 0.15 mm
2 PoE-ISO: clearance 2 mm to class 1
3 B2B-ISO: clearance 2 mm to class 1, clearance 2 mm to class 2
4 ESP32: clearance 2 mm to class 2, clearance 2 mm to class 3
5 Sheild: clearance 1.5 mm to class 1, clearance 2 mm to class 2, clearance 2 mm to class 3, clearance 1.5 mm to class 4